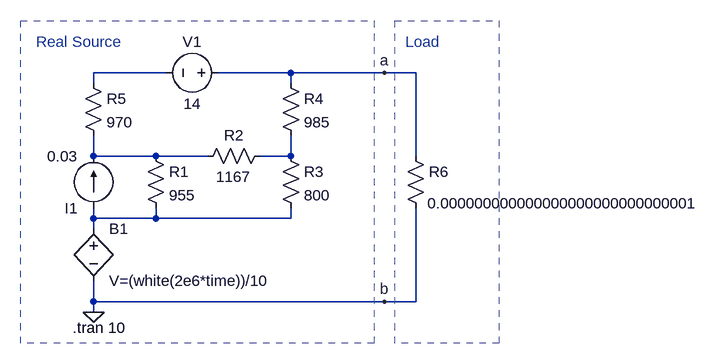
[diagram p0: schematic Var31.asc]
Var31.asc, the LTspice schematic file:
Version 4
SHEET 1 1248 680
WIRE -160 -208 -272 -208
WIRE 32 -208 -80 -208
WIRE 176 -208 32 -208
WIRE 224 -208 176 -208
WIRE -272 -192 -272 -208
WIRE 32 -192 32 -208
WIRE -272 -80 -272 -112
WIRE -176 -80 -272 -80
WIRE -96 -80 -176 -80
WIRE 32 -80 32 -112
WIRE 32 -80 -16 -80
WIRE 224 -80 224 -208
WIRE -272 16 -272 0
WIRE -176 16 -176 0
WIRE -176 16 -272 16
WIRE 32 16 32 0
WIRE 32 16 -176 16
WIRE -272 32 -272 16
WIRE -272 144 -272 112
WIRE 176 144 -272 144
WIRE 224 144 224 0
WIRE 224 144 176 144
WIRE -272 160 -272 144
FLAG -272 160 0
FLAG 176 -208 a
FLAG 176 144 b
SYMBOL bv -272 16 R0
SYMATTR InstName B1
SYMATTR Value V=(white(2e6*time))/10
SYMBOL current -272 0 R180
WINDOW 123 0 0 Left 0
WINDOW 39 0 0 Left 0
SYMATTR InstName I1
SYMATTR Value 0.03
SYMBOL res -192 -96 R0
SYMATTR InstName R1
SYMATTR Value 955
SYMBOL res 0 -96 R90
WINDOW 0 0 56 VBottom 2
WINDOW 3 32 56 VTop 2
SYMATTR InstName R2
SYMATTR Value 1167
SYMBOL res 16 -96 R0
SYMATTR InstName R3
SYMATTR Value 800
SYMBOL res 16 -208 R0
SYMATTR InstName R4
SYMATTR Value 985
SYMBOL res -288 -208 R0
SYMATTR InstName R5
SYMATTR Value 970
SYMBOL voltage -64 -208 R90
WINDOW 0 -32 56 VBottom 2
WINDOW 3 32 56 VTop 2
WINDOW 123 0 0 Left 0
WINDOW 39 0 0 Left 0
SYMATTR InstName V1
SYMATTR Value 14
SYMBOL res 208 -96 R0
WINDOW 3 34 89 Left 2
SYMATTR Value 0.000000000000000000000000000001
SYMATTR InstName R6
TEXT -304 184 Left 2 !.tran 10
TEXT -360 -256 Left 2 ;Real Source
TEXT 208 -256 Left 2 ;Load
RECTANGLE Normal 160 208 -384 -288 1
RECTANGLE Normal 352 208 192 -288 1

The netlist it stands for:
* Var31.asc
B1 N004 0 V=(white(2e6*time))/10
I1 N004 N002 0.03
R1 N002 N004 955
R2 N003 N002 1167
R3 N003 N004 800
R4 a N003 985
R5 N001 N002 970
V1 a N001 14
R6 a 0 0.000000000000000000000000000001
.tran 10
* Real Source
* Load
.backanno
.end